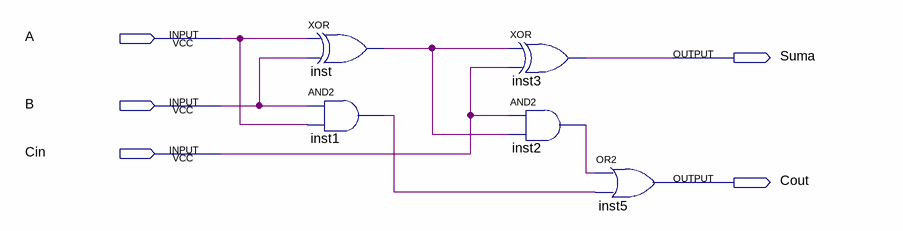
[diagram p0: schematic sheet]
// Quartus schematic SumadorGrande.bdf as structural Verilog: 5 symbols, 5 pins
module SumadorGrande (
  input  A,
  input  B,
  input  Cin,
  output Suma,
  output Cout
);

  wire inst1_out, inst2_out, inst_out;

  xor inst (inst_out, A, B);
  and inst1 (inst1_out, B, A);
  xor inst3 (Suma, inst_out, Cin);
  and inst2 (inst2_out, Cin, inst_out);
  or inst5 (Cout, inst2_out, inst1_out);
endmodule
